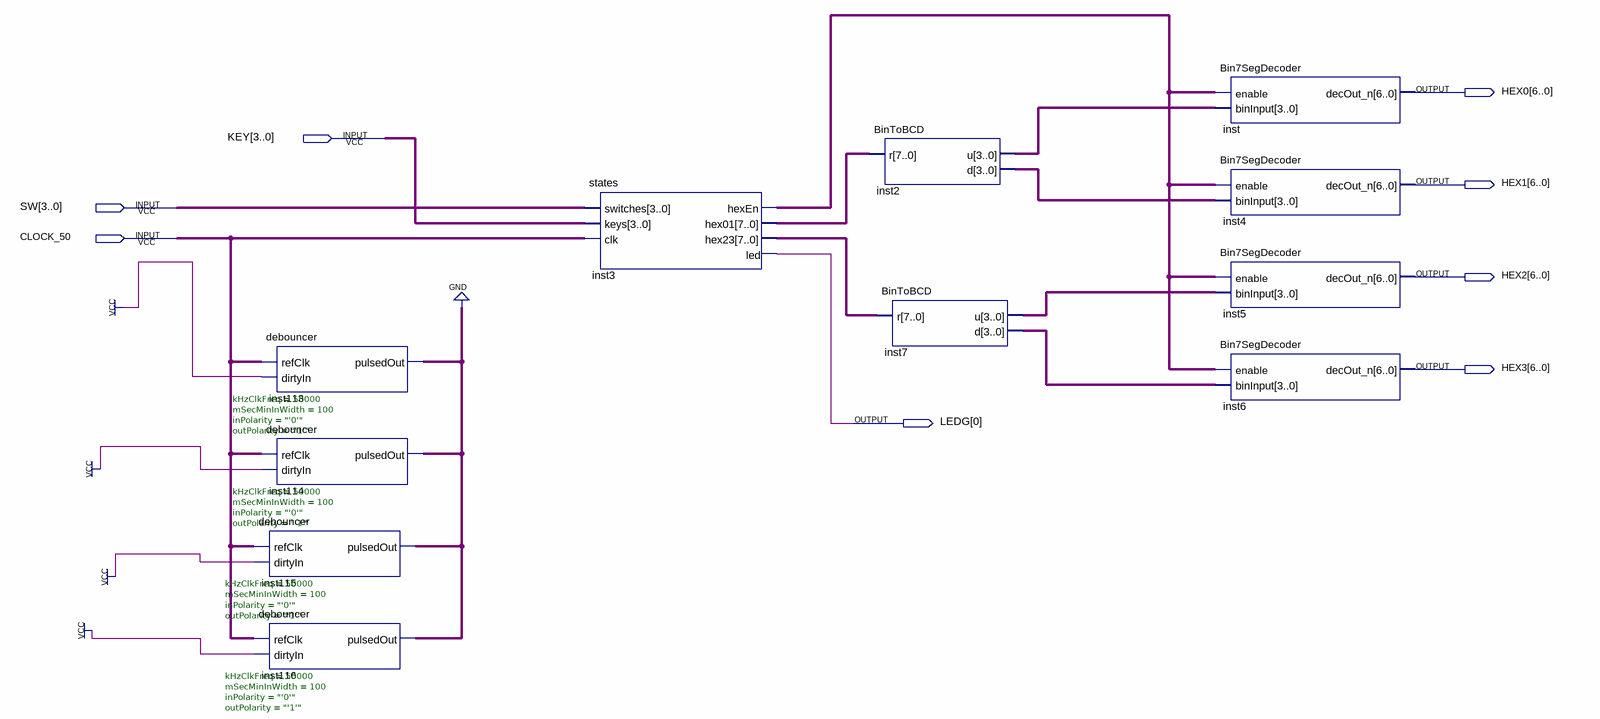
[diagram p0: schematic sheet]
// Quartus schematic bdf.bdf as structural Verilog: 11 symbols, 8 pins
module bdf (
  input  [3:0] KEY,
  input  [3:0] SW,
  input  CLOCK_50,
  output [6:0] HEX0,
  output [6:0] HEX1,
  output [6:0] HEX2,
  output [6:0] HEX3,
  output [0:0] LEDG
);

  wire inst3_hexen, inst113_pulsedout;
  wire [3:0] inst2_d, inst2_u, inst7_d, inst7_u;
  wire [7:0] inst3_hex01, inst3_hex23;

  debouncer #(.kHzClkFreq(50000), .mSecMinInWidth(100), .inPolarity("'0'"), .outPolarity("'1'")) inst113 (
    .refClk(CLOCK_50), .dirtyIn(1'b1), .pulsedOut(inst113_pulsedout));
  debouncer #(.kHzClkFreq(50000), .mSecMinInWidth(100), .inPolarity("'0'"), .outPolarity("'1'")) inst114 (
    .refClk(CLOCK_50), .dirtyIn(1'b1), .pulsedOut(inst113_pulsedout));
  debouncer #(.kHzClkFreq(50000), .mSecMinInWidth(100), .inPolarity("'0'"), .outPolarity("'1'")) inst115 (
    .refClk(CLOCK_50), .dirtyIn(1'b1), .pulsedOut(inst113_pulsedout));
  debouncer #(.kHzClkFreq(50000), .mSecMinInWidth(100), .inPolarity("'0'"), .outPolarity("'1'")) inst116 (
    .refClk(CLOCK_50), .dirtyIn(1'b1), .pulsedOut(inst113_pulsedout));
  states inst3 (
    .switches(SW), .keys(KEY), .clk(CLOCK_50), .hexEn(inst3_hexen), .hex01(inst3_hex01), .hex23(inst3_hex23),
    .led(LEDG[0]));
  BinToBCD inst2 (.r(inst3_hex01), .u(inst2_u), .d(inst2_d));
  BinToBCD inst7 (.r(inst3_hex23), .u(inst7_u), .d(inst7_d));
  Bin7SegDecoder inst (.enable(inst3_hexen), .binInput(inst2_u), .decOut_n(HEX0));
  Bin7SegDecoder inst4 (.enable(inst3_hexen), .binInput(inst2_d), .decOut_n(HEX1));
  Bin7SegDecoder inst5 (.enable(inst3_hexen), .binInput(inst7_u), .decOut_n(HEX2));
  Bin7SegDecoder inst6 (.enable(inst3_hexen), .binInput(inst7_d), .decOut_n(HEX3));
  // also tied to GND on the sheet: inst113_pulsedout
endmodule
